# EAGLE schematic RevA (EAGLE 9.2.1)
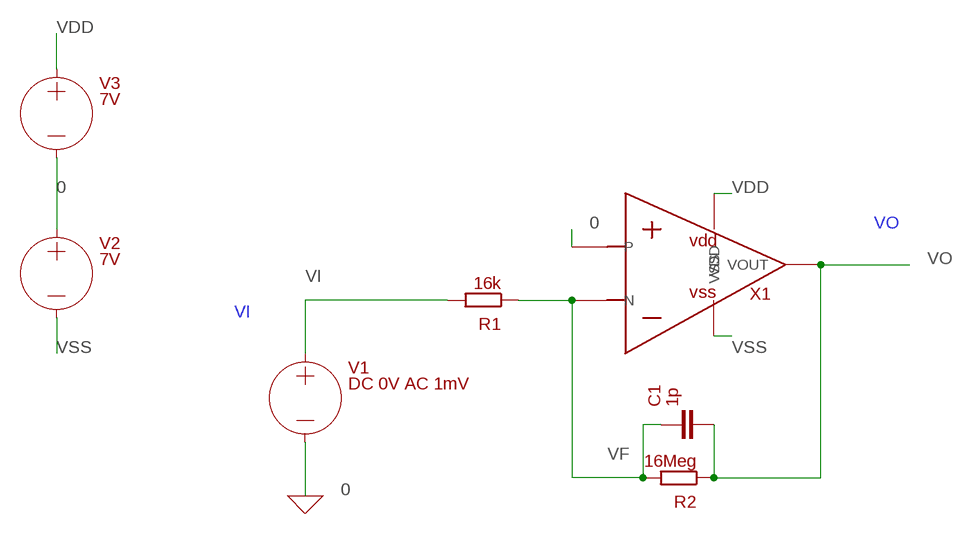
[diagram p0: schematic, sheet 1]

## Parts
C1  1p  C  (no package)
R1  16k  R  (no package)
R2  16Meg  R  (no package)
V1  DC 0V AC 1mV  VOLTAGE  (no package)
V2  7V  VOLTAGE  (no package)
V3  7V  VOLTAGE  (no package)
X1  OPAMP  (no package)

## Nets
0: V1.- V2.+ V3.- X1.P ; supply symbol labelled GND
VDD: V3.+ X1.VDD
VF: C1.1 R1.1 R2.2 X1.N
VI: R1.2 V1.+
VO: C1.2 R2.1 X1.VOUT
VSS: V2.- X1.VSS

## Library data of the parts
C1 = ngspice-simulation:C: CAPACITOR
R1 R2 = ngspice-simulation:R: RESISTOR
V1-V3 = ngspice-simulation:VOLTAGE: Independent Voltage Source, either DC, AC, PULSE, SINE, PWL, EXP, or SFFM; VALUE: 0V
X1 = ngspice-simulation:OPAMP: Operational amplifier with power pins; SPICEPREFIX: X